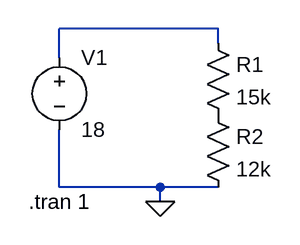
[diagram p0: schematic Voltage_Divider.asc]
Voltage_Divider.asc, the LTspice schematic file:
Version 4
SHEET 1 880 680
WIRE 224 48 48 48
WIRE 224 64 224 48
WIRE 48 80 48 48
WIRE 48 224 48 160
WIRE 160 224 48 224
WIRE 224 224 160 224
WIRE 160 240 160 224
FLAG 160 240 0
SYMBOL voltage 48 64 R0
WINDOW 123 0 0 Left 0
WINDOW 39 0 0 Left 0
SYMATTR InstName V1
SYMATTR Value 18
SYMBOL res 208 48 R0
SYMATTR InstName R1
SYMATTR Value 15k
SYMBOL res 208 128 R0
SYMATTR InstName R2
SYMATTR Value 12k
TEXT 14 240 Left 2 !.tran 1

The netlist it stands for:
* Voltage_Divider.asc
V1 N001 0 18
R1 N001 P001 15k
R2 P001 0 12k
.tran 1
.backanno
.end